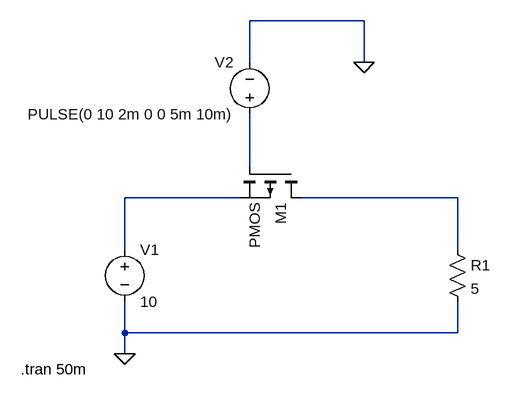
[diagram p0: schematic pnp.asc]
pnp.asc, the LTspice schematic file:
Version 4.1
SHEET 1 880 680
WIRE 320 -208 144 -208
WIRE 144 -144 144 -208
WIRE 320 -144 320 -208
WIRE 144 16 144 -64
WIRE 128 64 -48 64
WIRE 464 64 224 64
WIRE -48 144 -48 64
WIRE 464 144 464 64
WIRE -48 272 -48 224
WIRE 464 272 464 224
WIRE 464 272 -48 272
WIRE -48 304 -48 272
FLAG -48 304 0
FLAG 320 -144 0
SYMBOL voltage -48 128 R0
WINDOW 123 0 0 Left 0
WINDOW 39 0 0 Left 0
SYMATTR InstName V1
SYMATTR Value 10
SYMBOL pmos 224 16 R90
SYMATTR InstName M1
SYMBOL voltage 144 -48 R180
WINDOW 0 24 96 Left 2
WINDOW 3 24 16 Left 2
WINDOW 123 0 0 Left 0
WINDOW 39 0 0 Left 0
SYMATTR InstName V2
SYMATTR Value PULSE(0 10 2m 0 0 5m 10m)
SYMBOL res 448 128 R0
SYMATTR InstName R1
SYMATTR Value 5
TEXT -208 328 Left 2 !.tran 50m

The netlist it stands for:
* pnp.asc
V1 N002 0 10
M1 N003 N001 N002 N002 PMOS
V2 N001 0 PULSE(0 10 2m 0 0 5m 10m)
R1 N003 0 5
.model NMOS NMOS
.model PMOS PMOS
.lib standard.mos
.tran 50m
.backanno
.end